# EAGLE design thermal-flashlight-32u4 (EAGLE 6.5.0)
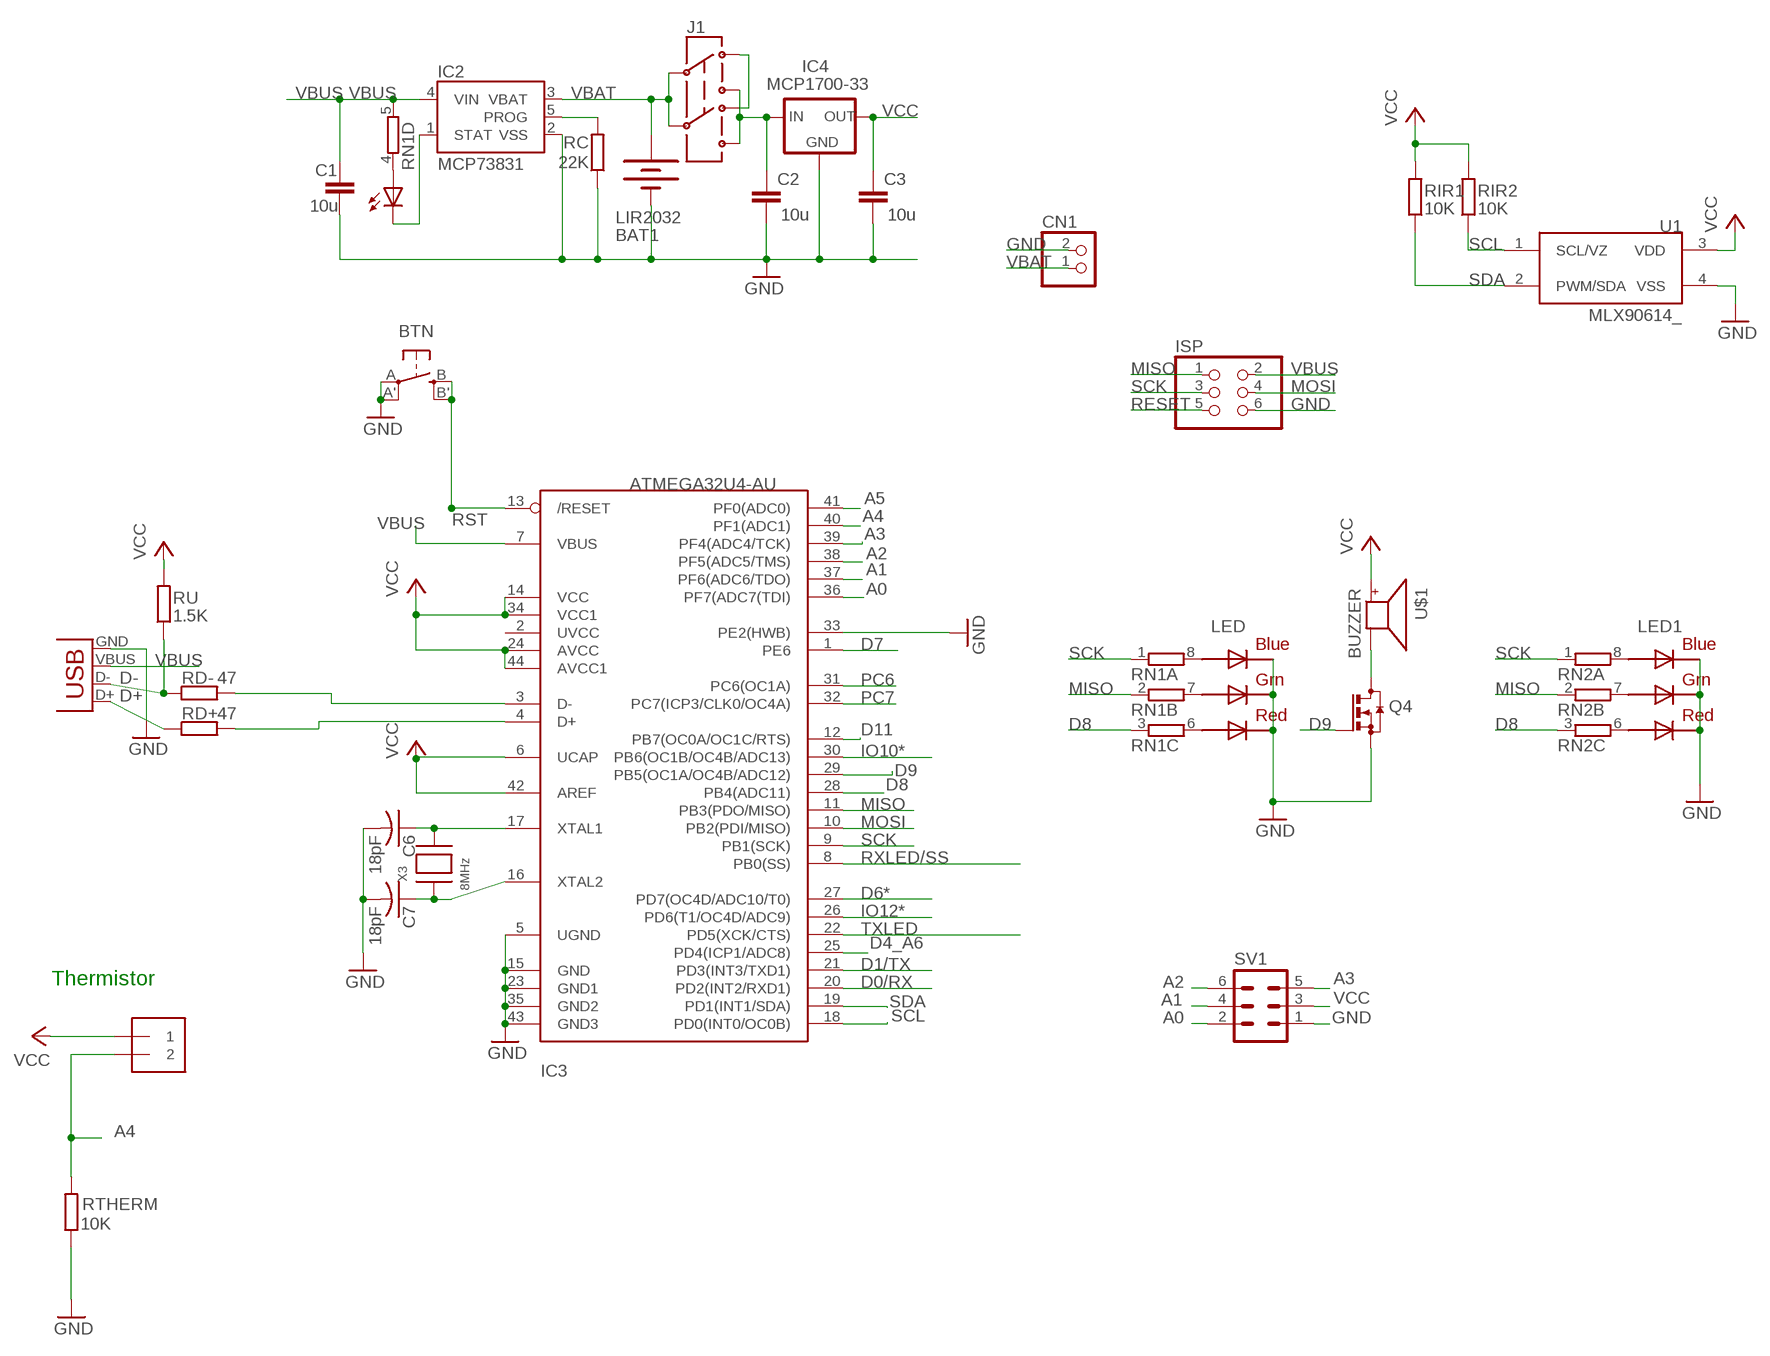
[diagram p0: schematic, sheet 1]

## Parts
BAT1  LIR2032  BATTERYBATTCOM_20MM_PTH_SMT  [BATTCOM_20MM_PTH_SMT]
BTN  EVQQ2  [EVQ-Q2]
C1  10u  C-EUC0805  [C0805]
C2  10u  C-EUC0805  [C0805]
C3  10u  C-EUC0805  [C0805]
C6  18pF  C-USC0805K  [C0805K]
C7  18pF  C-USC0805K  [C0805K]
CHG  0805  LEDCHIPLED_0805  [CHIPLED_0805]
CN1  JST_2PIN-SMT-RA  [JST-PH-2-SMT-RA]
IC2  MCP73831  [SOT23-5]
IC3  ATMEGA32U4-AU  [TQFP44]
IC4  MCP1700-33  MCP1700SOT233  [SOT23]
ISP  PINHD-2X3  [2X03]
J1  AYZ0202  [AYZ0202]
J2  1X2-3.5MM  [1X2-3.5MM]
LED  RGBLED5050  [RGBLED5050]
LED1  RGBLED5050  [RGBLED5050]
Q4  BSS123  [SOT23]
RC  22K  R-EU_R0805  [R0805]
RD+  47  R-EU_R0805  [R0805]
RD-  47  R-EU_R0805  [R0805]
RIR1  10K  R-EU_R0805  [R0805]
RIR2  10K  R-EU_R0805  [R0805]
RN1  4R-NEXB38V  [EXB38V]
RN2  4R-NEXB38V  [EXB38V]
RTHERM  10K  R-EU_R0805  [R0805]
RU  1.5K  R-EU_R0805  [R0805]
SV1  MA03-2  [MA03-2]
U1  MLX90614_  [TO-39]
U$1  BUZZER  [SMT-8585-BUZZER]
X1  USBSMD  [USB-MINIB]
X3  8MHz  XTALNX5032  [NX5032]

## Nets
A0: IC3.36(PF7(ADC7(TDI)) SV1.2
A1: IC3.37(PF6(ADC6/TDO)) SV1.4
A2: IC3.38(PF5(ADC5/TMS)) SV1.6
A3: IC3.39(PF4(ADC4/TCK)) SV1.5
A4: IC3.40(PF1(ADC1)) J2.2 RTHERM.2
A5: IC3.41(PF0(ADC0))
D0/RX: IC3.20(PD2(INT2/RXD1))
D1/TX: IC3.21(PD3(INT3/TXD1))
D4_A6: IC3.25(PD4(ICP1/ADC8))
D6*: IC3.27(PD7(OC4D/ADC10/T0))
D7: IC3.1(PE6)
D8: IC3.28(PB4(ADC11)) RN1.3 RN2.3
D9: IC3.29(PB5(OC1A/OC4B/ADC12)) Q4.1(G)
D11: IC3.12(PB7(OC0A/OC1C/RTS))
D+: RD+.1 X1.D+
D-: RD-.1 RU.1 X1.D-
GND: BAT1.P$1(-) BTN.A'(P1) BTN.A(P) C1.2 C2.2 C3.2 C6.2 C7.2 CN1.2 IC2.2(VSS) IC3.5(UGND) IC3.15(GND) IC3.23(GND1) IC3.33(PE2(HWB)) IC3.35(GND2) IC3.43(GND3) IC4.1(GND) ISP.6 LED1.4(BLUE_C) LED1.5(RED_C) LED1.6(GREEN_C) LED.4(BLUE_C) LED.5(RED_C) LED.6(GREEN_C) Q4.2(S) RC.1 RTHERM.1 SV1.1 U1.4(VSS) X1.GND
IO10*: IC3.30(PB6(OC1B/OC4B/ADC13))
IO12*: IC3.26(PD6(T1/OC4D/ADC9))
MISO: IC3.11(PB3(PDO/MISO)) ISP.1 RN1.2 RN2.2
MOSI: IC3.10(PB2(PDI/MISO)) ISP.4
N$1: J1.3 J1.6
N$2: LED1.3(BLUE_A) RN2.8
N$3: LED1.1(GREEN_A) RN2.7
N$4: LED.3(BLUE_A) RN1.8
N$5: CHG.C IC2.1(STAT)
N$6: IC2.5(PROG) RC.2
N$7: Q4.3(D) U$1.-
N$8: LED.1(GREEN_A) RN1.7
N$9: LED.2(RED_A) RN1.6
N$10: CHG.A RN1.4
N$11: IC3.4(D+) RD+.2
N$12: LED1.2(RED_A) RN2.6
N$15: C7.1 IC3.16(XTAL2) X3.P$1
N$16: C6.1 IC3.17(XTAL1) X3.P$2
N$18: IC3.3(D-) RD-.2
PC6: IC3.31(PC6(OC1A))
PC7: IC3.32(PC7(ICP3/CLK0/OC4A))
RESET: ISP.5
RST: BTN.B'(S1) BTN.B(S) IC3.13(/RESET)
RXLED/SS: IC3.8(PB0(SS))
SCK: IC3.9(PB1(SCK)) ISP.3 RN1.1 RN2.1
SCL: IC3.18(PD0(INT0/OC0B)) RIR2.1 U1.1(SCL/VZ)
SDA: IC3.19(PD1(INT1/SDA)) RIR1.1 U1.2(PWM/SDA)
TXLED: IC3.22(PD5(XCK/CTS))
VBAT: BAT1.P$2(+) CN1.1 IC2.3(VBAT) J1.2 J1.5
VBUS: C1.1 IC2.4(VIN) IC3.7(VBUS) ISP.2 RN1.5 X1.VBUS
VCC: C3.1 IC3.6(UCAP) IC3.14(VCC) IC3.24(AVCC) IC3.34(VCC1) IC3.42(AREF) IC3.44(AVCC1) IC4.2(OUT) J2.1 RIR1.2 RIR2.2 RU.2 SV1.3 U1.3(VDD) U$1.+
VDD: C2.1 IC4.3(IN) J1.1 J1.4
Unconnected: IC3.2(UVCC) RN2.4 RN2.5

## Notes on the sheet
- Thermistor

## Library data of the parts
BAT1 = SparkFunNew:BATTERY: Battery Holders Various common sizes : AA, AAA, 20mm coin cell and 12mm coin cell.
BTN = adafruit:EVQQ2: SMT 6mm switch, EVQQ2 series http://www.ladyada.net/library/eagle
C1-C3 = resistor:C-EU: CAPACITOR, European symbol
C6 C7 = adafruit:C-US: CAPACITOR, American symbol
CHG = led:LED: LED OSRAM: - CHIPLED LG R971, LG N971, LY N971, LG Q971, LY Q971, LO R971, LY R971 LH N974, LH R974 LS Q976, LO Q976, LY Q976 LO Q996 - Hyper CHIPLED LW Q18S LB Q993, LB Q99A, LB R99A - SideLED LS A670, LO A670, LY A670, LG A670, LP A670 LB A673, LV A673, LT A673, LW A673 LH A674 LY A675 LS A676, LA A676, LO A676, LY A676, LW A676 LS A679, LY A679, LG A679 - Hyper Micro SIDELED® LS Y876, LA Y876, LO Y876, LY Y876 LT Y87S - SmartLED LW L88C, LW L88S LB L89C, LB L89S, LG L890 LS L89K, LO L89K, LY L89K LS L896, LA L896, LO L896, LY L896 - TOPLED LS T670, LO T670, LY T670, LG T670, LP T670 LSG T670, LSP T670, LSY T670, LOP T670, LYG T670 LG T671, LOG T671, LSG T671 LB T673, LV T673, LT T673, LW T673 LH T674 LS T676, LA T676, LO T676, LY T676, LB T676, LH T676, LSB T676, LW T676 LB T67C, LV T67C, LT T67C, LS T67K, LO T67K, LY T67K, LW E67C LS E67B, LA E67B, LO E67B, LY E67B, LB E67C, LV E67C, LT E67C LW T67C LS T679, LY T679, LG T679 LS T770, LO T770, LY T770, LG T770, LP T770 LB T773, LV T773, LT T773, LW T773 LH T774 LS E675, LA E675, LY E675, LS T675 LS T776, LA T776, LO T776, LY T776, LB T776 LHGB T686 LT T68C, LB T68C - Hyper Mini TOPLED® LB M676 - Mini TOPLED Santana® LG M470 LS M47K, LO M47K, LY M47K Source: http://www.osram.convergy.de LUXEON: - LUMILED® LXK2-PW12-R00, LXK2-PW12-S00, LXK2-PW14-U00, LXK2-PW14-V00 LXK2-PM12-R00, LXK2-PM12-S00, LXK2-PM14-U00 LXK2-PE12-Q00, LXK2-PE12-R00, LXK2-PE12-S00, LXK2-PE14-T00, LXK2-PE14-U00 LXK2-PB12-K00, LXK2-PB12-L00, LXK2-PB12-M00, LXK2-PB14-N00, LXK2-PB14-P00, LXK2-PB14-Q00 LXK2-PR12-L00, LXK2-PR12-M00, LXK2-PR14-Q00, LXK2-PR14-R00 LXK2-PD12-Q00, LXK2-PD12-R00, LXK2-PD12-S00 LXK2-PH12-R00, LXK2-PH12-S00 LXK2-PL12-P00, LXK2-PL12-Q00, LXK2-PL12-R00 Source: www.luxeon.com KINGBRIGHT: KA-3528ASYC Source: www.kingbright.com
CN1 = adafruit:JST_2PIN: JST 2-Pin Connectors of various flavors SMT-RA (S2B-PH-SM4) 4UConnector #17311 SMT (B2B-PH-SM4) THM-RA (S2B-PH) THM (B2B-PH)
IC2 = SparkFunNew:MCP73831: Microchip's MCP73831 Miniature single cell, fully integrated Li-Ion, Li-polymer charge management controller http://ww1.microchip.com/downloads/en/DeviceDoc/21984a.pdf
IC3 = adaprog:ATMEGA32U4
IC4 = adafruit:MCP1700: VOLTAGE REGULATOR
ISP = pinhead:PINHD-2X3: PIN HEADER
J1 = SparkFunNew:AYZ0202: SPDT Slide Switch Simple SMD single-pull double-throw slide switch. Good for less than 350mA power switch, switching UARTs between devices, etc. Spark Fun Electronics SKU : COM-00597
J2 = adafruit:1X2: 3.5mm Terminal block http://www.ladyada.net/library/pcb/eaglelibrary.html
LED LED1 = adafruit:RGBLED: For 5050 RGB LEDs, the order of the LEDs may vary from one manufacturer to another!
Q4 = transistor-small-signal:BSS123: N-CHANNEL MOS FET
RC RD+ RD- RIR1 RIR2 RTHERM RU = rcl:R-EU_: RESISTOR, European symbol
RN1 RN2 = resistor-dil:4R-N: Array Chip Resistor Source: RS Component / Phycomp; OC_FARNELL: unknown; OC_NEWARK: unknown
SV1 = con-lstb:MA03-2: PIN HEADER; OC_FARNELL: unknown; OC_NEWARK: unknown
U1 = SparkFun:MLX90614: Melexis IR Thermometer
U$1 = adafruit:BUZZER
X1 = SparkFun:USB: USB Connectors USB-B-PTH is fully proven SKU : PRT-00139 USB-miniB is fully proven SKU : PRT-00587 USB-A-PCB is untested. USB-A-H is throughly reviewed, but untested. Spark Fun Electronics SKU : PRT-00437 USB-B-SMT is throughly reviewed, but untested. Needs silkscreen touching up. USB-A-S has not been used/tested USB-MB-H has not been used/tested
X3 = adaprog:XTAL

## Net classes
1 power: width 0.254 mm, clearance 0.203 mm

## Board
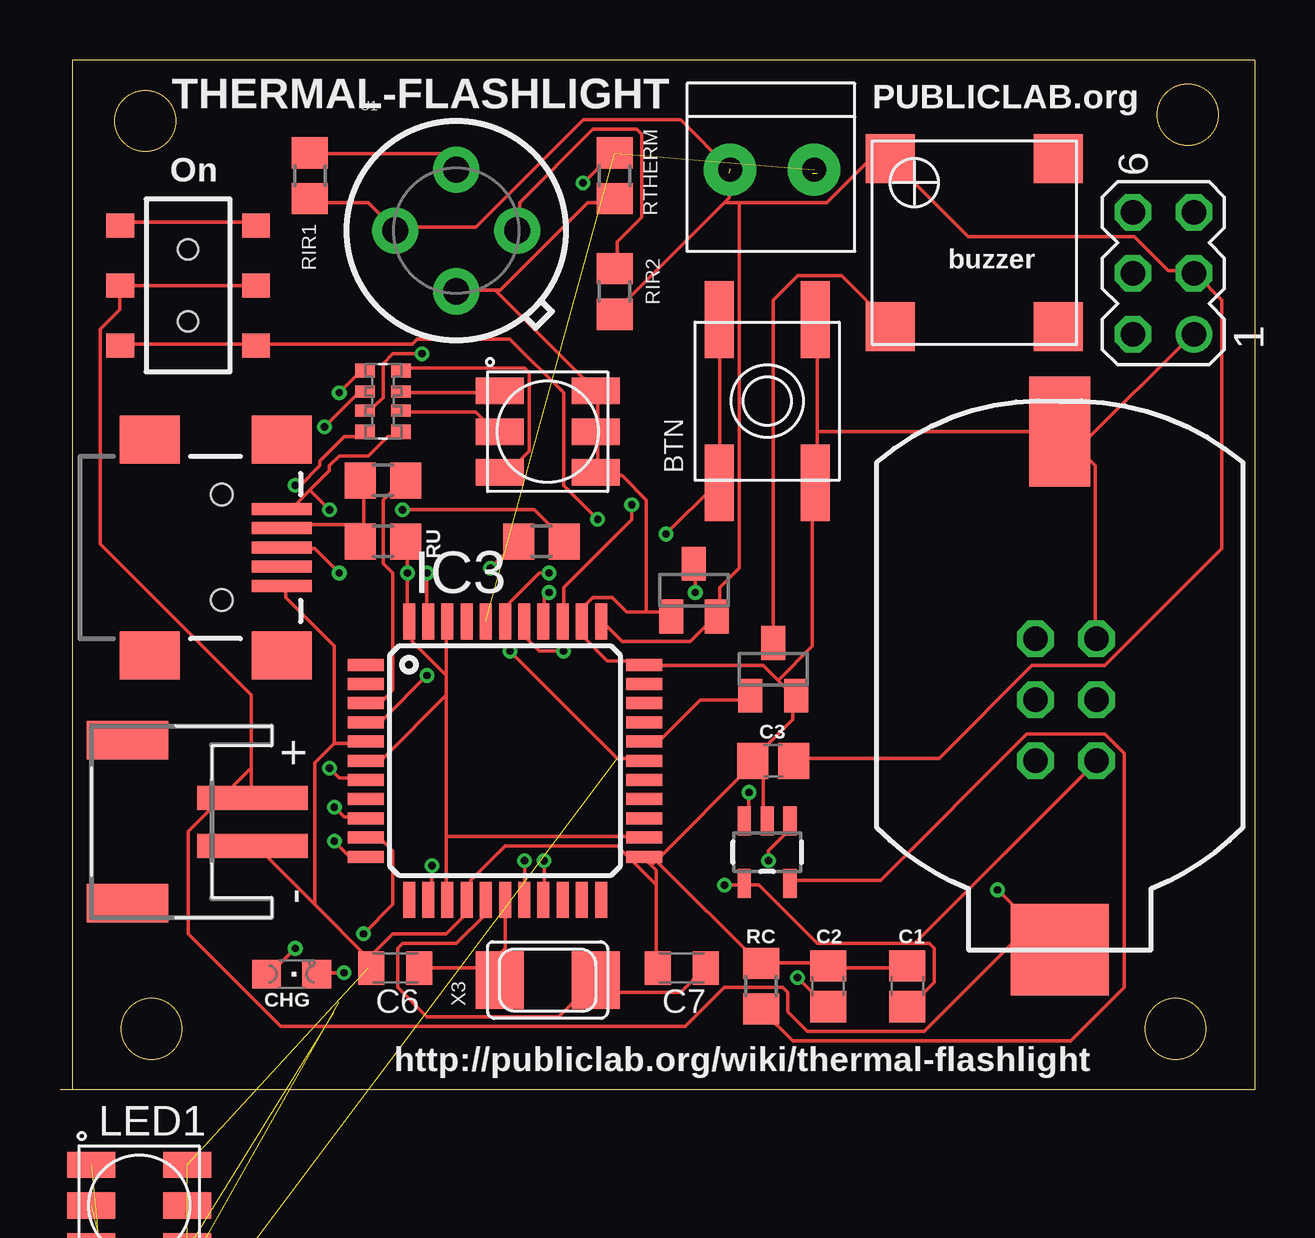
[diagram p1: board, top side]
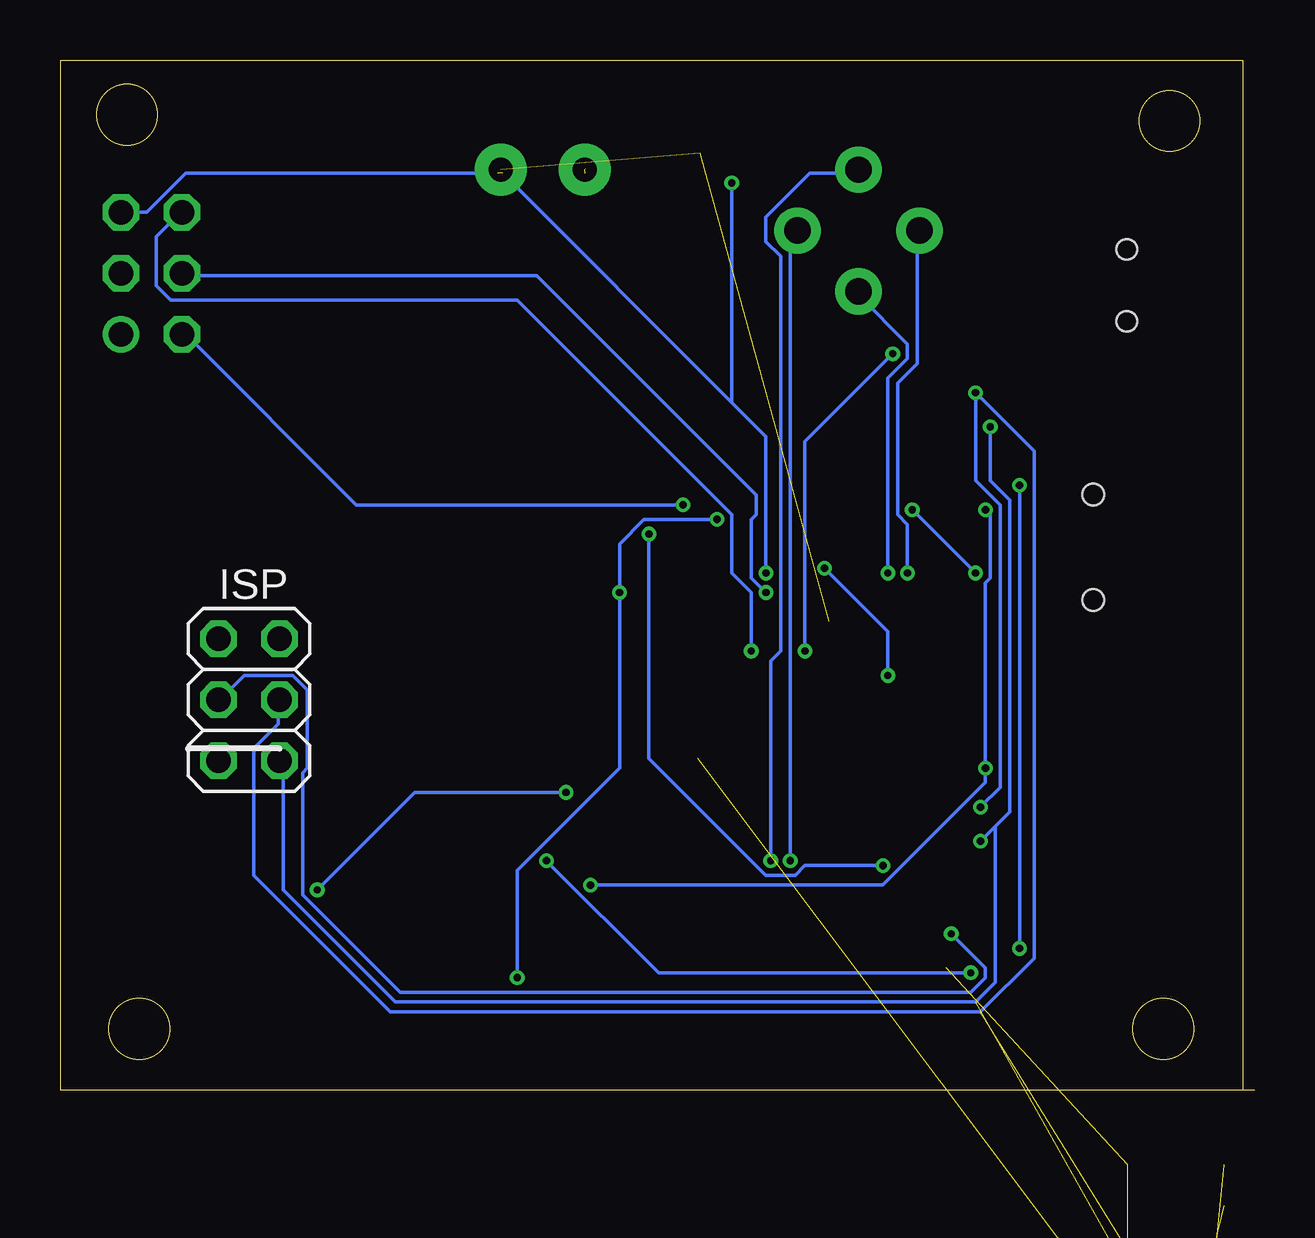
[diagram p2: board, bottom side, seen from below]

Size 49.78 x 42.93 mm. Coordinates in mm from the lower left corner, seen from the top.
Outline: 0.51,0 49.78,0 49.78,42.93 0.51,42.93 0.51,0
Outline: 0.51,0 0,0
Outline: circle at 3.81,2.54 radius 1.27
Outline: circle at 3.56,40.39 radius 1.27
Outline: circle at 46.99,40.64 radius 1.27
Outline: circle at 46.48,2.54 radius 1.27
Copper layers (1*16): Top 0.035mm / dielectric 1.5mm / Bottom 0.035mm
Design rules "Fusion_eagle_rule_v1.1 *": minimum track width 6mil, minimum drill 12mil, track to track 6mil, track to pad 6mil, pad to pad 6mil, via to via 6mil, smd to smd 0mil, copper to edge 10mil, drill to drill 10mil, minimum pad ring 10mil, minimum via ring 6mil, stop-mask expansion 2mil, vias tented up to drill 100mil, thermal gap 25mil
vRestrict: area 8.9,4.3 to 10.4,5.1

### Footprints (pad centres in the part's own frame; a part is rotated, then mirrored left to right if it is on the bottom)
BATTCOM_20MM_PTH_SMT = smd 4.572 x 2.54: P$1 0,0 | smd 3.81 x 4.064: P$2 21.59,0
EVQ-Q2 = smd 3.2 x 1.2: A -3.4,-2; A' 3.4,-2; B -3.4,2; B' 3.4,2
C0805 = smd 1.3 x 1.5: 1 -0.85,0; 2 0.85,0
C0805K = smd 1.1 x 1.4: 1 -1,0; 2 1,0
CHIPLED_0805 = smd 1.2 x 1.2: A 0,-1.05; C 0,1.05
JST-PH-2-SMT-RA = smd 1 x 4.6: 1 1,-3.7; 2 -1,-3.7 | smd 1.6 x 3.4: NC1 -3.4,1.5; NC2 3.4,1.5
SOT23-5 = smd 0.55 x 1.2: 1 -0.95,-1.3; 2 0,-1.3; 3 0.95,-1.3; 4 0.95,1.3; 5 -0.95,1.3
TQFP44 = smd 1.5 x 0.5: 1 -5.8,4; 2 -5.8,3.2; 3 -5.8,2.4; 4 -5.8,1.6; 5 -5.8,0.8; 6 -5.8,0; 7 -5.8,-0.8; 8 -5.8,-1.6; 9 -5.8,-2.4; 10 -5.8,-3.2; 11 -5.8,-4; 23 5.8,-4; 24 5.8,-3.2; 25 5.8,-2.4; 26 5.8,-1.6; 27 5.8,-0.8; 28 5.8,0; 29 5.8,0.8; 30 5.8,1.6; 31 5.8,2.4; 32 5.8,3.2; 33 5.8,4 | smd 0.5 x 1.5: 12 -4,-5.8; 13 -3.2,-5.8; 14 -2.4,-5.8; 15 -1.6,-5.8; 16 -0.8,-5.8; 17 0,-5.8; 18 0.8,-5.8; 19 1.6,-5.8; 20 2.4,-5.8; 21 3.2,-5.8; 22 4,-5.8; 34 4,5.8; 35 3.2,5.8; 36 2.4,5.8; 37 1.6,5.8; 38 0.8,5.8; 39 0,5.8; 40 -0.8,5.8; 41 -1.6,5.8; 42 -2.4,5.8; 43 -3.2,5.8; 44 -4,5.8
SOT23 = smd 1 x 1.4: 1 -0.95,-1.1; 2 0.95,-1.1; 3 0,1.1
2X03 = drill 1.016 octagon: 1 -2.54,-1.27; 2 -2.54,1.27; 3 0,-1.27; 4 0,1.27; 5 2.54,-1.27; 6 2.54,1.27
AYZ0202 = smd 1 x 1.15: 1 -2.5,2.825; 2 0,2.825; 3 2.5,2.825; 4 -2.5,-2.825; 5 0,-2.825; 6 2.5,-2.825 | hole 0.85: 1.5,0; -1.5,0
1X2-3.5MM = drill 1 pad 2.184: 1 1.8,0; 2 -1.7,0
RGBLED5050 = smd 2 x 1.1: 1 -2,1.7; 2 -2,0; 3 -2,-1.7; 4 2,-1.7; 5 2,0; 6 2,1.7
R0805 = smd 1.3 x 1.5: 1 -0.95,0; 2 0.95,0
EXB38V = smd 0.6 x 0.8: 1 -1.275,-0.75; 4 1.275,-0.75; 5 1.275,0.75; 8 -1.275,0.75 | smd 0.5 x 0.8: 2 -0.4,-0.75; 3 0.4,-0.75; 6 0.4,0.75; 7 -0.4,0.75
MA03-2 = drill 1.016: 1 -2.54,-1.27 | drill 1.016 octagon: 2 -2.54,1.27; 3 0,-1.27; 4 0,1.27; 5 2.54,-1.27; 6 2.54,1.27
TO-39 = drill 1.1 pad 1.93: 1 2.54,0; 2 0,2.54; 3 -2.54,0; 4 0,-2.54
SMT-8585-BUZZER = smd 2.05 x 2.05: + -3.5,-3.5; - 3.5,-3.5; NC1 -3.5,3.5; NC2 3.5,3.5
USB-MINIB = smd 2.5 x 0.5: D+ 2.5,0; D- 2.5,0.8; GND 2.5,-1.6; ID 2.5,-0.8; VBUS 2.5,1.6 | smd 2.5 x 2: GND@1 -3,-4.5; GND@2 -3,4.5; GND@3 2.5,4.5; GND@4 2.5,-4.5 | hole 0.9: 0,2.2; 0,-2.2
NX5032 = smd 2 x 2.4: P$1 2,0; P$2 -2,0

### Placement (x,y rotation side)
BAT1  41.66,27.43 270 top
BTN  29.46,28.7 90 top
C1  35.31,4.32 90 top
C2  32,4.32 90 top
C3  29.72,13.72 180 top
C6  13.97,5.08 180 top
C7  25.91,5.08 180 top
CHG  9.65,4.83 270 top
CN1  4.32,11.18 90 top
IC2  29.46,9.91 180 top
IC3  18.54,13.72 0 top
IC4  26.42,20.83 0 top
ISP  41.91,16.26 90 bottom
J1  5.33,33.53 90 top
J2  29.72,38.35 180 top
LED  20.32,27.43 0 top
LED1  3.3,-4.83 0 top  (outside the outline)
Q4  29.72,17.53 0 top
RC  29.21,4.32 270 top
RD+  20.07,22.86 180 top
RD-  13.46,25.4 0 top
RIR1  10.41,38.1 270 top
RIR2  23.11,33.27 270 top
RN1  13.46,28.7 270 top
RN2  2.54,-12.45 0 top  (outside the outline)
RTHERM  23.11,38.1 90 top
RU  13.46,22.86 0 top
SV1  45.97,34.04 90 top
U1  16.51,35.81 0 top
U$1  38.1,35.31 270 top
X1  6.73,22.61 0 top
X3  20.32,4.57 0 top

### Tracks (layer width: path | path; a pad name or v marks a point on that pad's centre or on a via)
A0  (via drill 0.3)
  Top 0.152: v23.83,24.38 23.83,23.77 20.98,20.93 20.98,19.71 IC3.36
  Bottom 0.152: v23.83,24.38 37.44,24.38 44.55,31.5 SV1.2
A1  (via drill 0.3)
  Top 0.152: v20.37,20.73 20.17,20.52 20.17,19.71 IC3.37
  Bottom 0.152: v20.37,20.73 20.98,21.34 20.98,23.77 20.78,23.98 20.78,24.79 29.92,33.93 44.55,33.93 SV1.4
A2  (via drill 0.3)
  Top 0.152: v20.98,18.29 19.96,18.29 19.36,18.9 19.36,19.51 IC3.38
  Bottom 0.152: v20.98,18.29 20.98,20.73 21.79,21.54 21.79,23.98 30.73,32.92 45.16,32.92 45.77,33.53 45.77,35.56 44.75,36.58 SV1.6
A3  (via drill 0.3)  (1 unrouted)
  Top 0.152: IC3.39 18.54,20.12 19.96,21.54 v20.37,21.54 | v21.79,37.8 23.01,39.01
  Bottom 0.152: v20.37,21.54 20.37,27.23 21.79,28.65 | 31.34,38.2 21.79,28.65 | 21.79,28.65 v21.79,37.8 | SV1.5 46.18,36.58 44.55,38.2 31.55,38.2
A4  (2 unrouted)
D8  (via drill 0.3)  (1 unrouted)
  Top 0.152: v15.09,30.68 13.87,30.68 13.46,30.28 13.46,28.85 13.06,28.45 12.85,28.45 RN1.3 | v18.75,18.29 23.22,13.82 24.23,13.82 IC3.28
  Bottom 0.152: v15.09,30.68 18.75,27.03 v18.75,18.29
D9
  Top 0.152: Q4.1 28.7,16.26 26.67,16.26 25.04,14.63 24.44,14.63 IC3.29
D+  (via drill 0.3)
  Top 0.152: v14.28,24.18 19.76,24.18 20.98,22.96 RD+.1 | v11.63,21.54 10.62,22.55 9.4,22.55 X1.D+
  Bottom 0.152: v11.63,21.54 v14.28,24.18
D-
  Top 0.152: 12.65,23.57 12.65,25.4 RD-.1 | 12.65,23.57 12.65,22.96 RU.1 12.65,23.57 | 12.65,23.57 9.4,23.57 X1.D-
GND  (via drill 0.3)  (3 unrouted)
  Top 0.152: 31.55,27.43 31.55,31.9 BTN.A' | 31.55,27.43 31.55,25.4 BTN.A 31.34,25.2 31.34,18.49 29.92,17.07 | 42.32,26.82 41.71,27.43 BAT1.P$1 | 42.32,26.82 43.13,26.01 43.13,18.9 ISP.6 | 42.32,26.82 42.52,26.82 47.19,31.5 SV1.1 | 42.32,26.82 BAT1.P$1 | BAT1.P$1 31.55,27.43 | 12.85,5.49 12.85,5.08 C6.2 12.85,5.49 | 10.62,7.72 8.18,10.16 CN1.2 | 10.62,7.72 12.85,5.49 | 12.85,5.49 13.87,6.5 16.1,6.5 16.92,7.32 16.92,7.72 IC3.15 17.12,7.92 17.12,8.74 18.54,10.16 23.22,10.16 24.84,8.53 | 11.43,14.43 12.65,14.43 IC3.5 | 11.43,14.43 10.62,13.61 10.62,7.72 | 11.43,14.43 11.43,18.49 9.4,20.52 9.4,20.93 X1.GND | 22.4,27.43 22.4,25.81 LED.4 22.4,25.6 23.42,25.6 24.44,24.59 24.44,19.91 | 22.4,27.43 22.4,29.06 LED.6 22.2,29.26 18.14,33.33 | 22.4,27.43 LED.5 | v15.29,21.54 15.29,19.71 IC3.43 | 18.14,33.33 16.51,33.33 U1.4 | 18.14,33.33 18.34,33.33 22,36.98 23.01,36.98 RTHERM.1 | C1.2 35.2,5.08 32.16,5.08 C2.2 31.95,5.28 29.31,5.28 RC.1 29.11,5.28 24.84,9.55 | 24.44,19.91 23.62,19.91 23.01,20.52 22.2,20.52 21.79,20.12 21.79,19.71 IC3.35 21.79,19.51 21.79,18.9 22.81,17.88 24.23,17.88 IC3.33 24.44,17.68 29.31,17.68 29.92,17.07 | 24.44,19.91 25.45,19.91 IC4.1 | 24.84,8.53 24.84,9.14 24.64,9.35 | 24.84,8.53 24.84,5.08 C7.2 | 24.64,9.35 24.44,9.55 IC3.23 24.84,9.55 | 28.91,13.61 29.31,13.21 29.31,11.38 IC2.2 | 28.91,13.61 24.84,9.55 | 24.84,9.55 24.64,9.35 | 28.91,13.61 C3.2 28.91,13.82 30.53,15.44 30.53,16.26 Q4.2 30.53,16.46 29.92,17.07
  Bottom 0.152: v15.29,21.54 15.29,29.67 14.48,30.48 14.48,31.09 16.51,33.12 U1.4
MISO  (via drill 0.3)  (1 unrouted)
  Top 0.152: v11.02,27.64 12.45,29.06 12.65,29.06 RN1.2 | v11.43,10.36 12.04,9.75 12.65,9.75 IC3.11
  Bottom 0.152: v11.02,27.64 11.02,25.4 10.21,24.59 10.21,11.58 10.82,10.97 | v11.43,10.36 10.82,10.97 | 10.82,10.97 10.82,4.47 11.63,3.66 35.81,3.66 40.49,8.33 40.49,13.61 ISP.1
MOSI  (via drill 0.3)
  Top 0.152: v12.65,6.5 13.87,7.72 13.87,9.96 13.46,10.36 12.85,10.36 IC3.10
  Bottom 0.152: v12.65,6.5 11.23,5.08 11.23,4.67 11.84,4.06 35.61,4.06 39.67,8.13 39.67,13.21 39.47,13.41 39.47,16.66 40.08,17.27 42.11,17.27 43.13,16.26 ISP.4
N$1
  Top 0.152: J1.3 2.69,36.17 7.98,36.17 J1.6
N$2  (1 unrouted)
N$3  (1 unrouted)
N$4
  Top 0.152: RN1.8 14.28,30.07 19.36,30.07 19.56,29.87 19.56,26.62 18.75,25.81 18.34,25.81 LED.3
N$5  (via drill 0.3)
  Top 0.152: v11.84,4.88 10.82,4.88 CHG.C | v29.52,9.55 29.52,9.96 30.33,10.77 30.33,11.18 IC2.1
  Bottom 0.152: v11.84,4.88 24.84,4.88 v29.52,9.55
N$6
  Top 0.152: IC2.5 30.53,8.74 34.19,8.74 40.28,14.83 43.54,14.83 44.35,14.02 44.35,4.27 42.11,2.03 30.53,2.03 29.31,3.25 RC.2
N$7
  Top 0.152: Q4.3 29.72,32.92 30.73,33.93 32.56,33.93 34.59,31.9 U$1.-
N$8
  Top 0.152: RN1.7 14.28,29.06 18.14,29.06 LED.1
N$9
  Top 0.152: RN1.6 14.28,28.25 17.32,28.25 18.14,27.43 LED.2
N$10  (via drill 0.3)
  Top 0.152: v9.8,25.2 10.01,25.2 10.82,26.01 10.82,26.21 11.84,27.23 12.65,27.23 RN1.4 | v9.8,5.89 8.79,4.88 CHG.A
  Bottom 0.152: v9.8,5.89 v9.8,25.2
N$11  (via drill 0.3)
  Top 0.152: v15.29,17.27 13.46,15.44 12.85,15.44 IC3.4 | v17.93,21.74 18.95,22.76 RD+.2
  Bottom 0.152: v15.29,17.27 15.29,19.1 v17.93,21.74
N$12  (1 unrouted)
N$15
  Top 0.152: C7.1 26.87,5.08 25.86,4.06 22.81,4.06 22.4,4.47 X3.P$1 22.2,4.47 20.78,3.05 15.29,3.05 14.07,4.27 14.07,5.89 14.28,6.1 16.51,6.1 17.73,7.32 17.73,7.72 IC3.16
N$16
  Top 0.152: 17.73,5.08 C6.1 | 17.73,5.08 18.14,4.67 X3.P$2 17.73,5.08 | IC3.17 18.54,5.89 17.73,5.08
N$18
  Top 0.152: IC3.3 12.85,16.26 13.46,16.26 13.87,16.66 13.87,21.54 13.46,21.95 13.46,24.59 14.28,25.4 RD-.2
RST  (via drill 0.3)
  Top 0.152: v15.49,9.35 15.49,7.92 IC3.13 | v25.25,23.16 27.28,25.2 BTN.B 27.48,25.4 27.48,31.9 BTN.B'
  Bottom 0.152: v15.49,9.35 18.75,9.35 19.15,8.94 20.37,8.94 25.25,13.82 v25.25,23.16
SCK  (via drill 0.3)  (1 unrouted)
  Top 0.152: v11.63,29.06 12.45,29.87 12.65,29.87 RN1.1 | v11.43,11.79 11.84,11.38 12.65,11.38 IC3.9
  Bottom 0.152: v11.43,11.79 10.62,12.6 10.62,24.38 11.63,25.4 v11.63,29.06 9.2,26.62 9.2,5.49 11.43,3.25 36.02,3.25 41.71,8.94 41.71,14.22 40.69,15.24 40.69,16.26 ISP.3
SCL  (via drill 0.3)
  Top 0.152: v19.36,9.55 IC3.18 | RIR2.1 23.22,34.34 23.22,35.36 24.23,36.37 24.23,39.83 24.03,40.03 22.2,40.03 19.15,36.98 19.15,35.97 U1.1
  Bottom 0.152: v19.36,9.55 19.36,35.56 19.15,35.76 U1.1
SDA  (via drill 0.3)
  Top 0.152: v20.17,9.55 20.17,7.92 IC3.19 | RIR1.1 10.41,39.01 15.9,39.01 16.51,38.41 U1.2
  Bottom 0.152: v20.17,9.55 20.17,17.88 19.76,18.29 19.76,34.75 20.37,35.36 20.37,36.37 18.54,38.2 16.51,38.2 U1.2
VBAT  (via drill 0.3)
  Top 0.152: v28.7,12.39 28.7,11.38 IC2.3 | 40.49,6.91 41.5,5.89 BAT1.P$2 40.49,6.91 | 40.49,6.91 v39.06,8.33 | J1.5 J1.2 2.49,33.53 2.49,32.51 1.68,31.7 1.68,22.76 7.98,16.46 7.98,13.41 | 7.98,13.41 7.98,12.19 CN1.1 | 40.49,6.91 36.02,2.44 31.14,2.44 30.33,3.25 30.33,4.06 30.12,4.27 27.69,4.27 26.06,2.64 9.2,2.64 5.33,6.5 5.33,10.77 7.98,13.41
  Bottom 0.152: v28.7,12.39 35,12.39 v39.06,8.33
VBUS  (via drill 0.3)
  Top 0.152: 10.41,24.99 9.8,24.38 9.4,24.38 X1.VBUS | 10.41,24.99 11.23,25.81 11.23,26.01 11.63,26.42 12.85,26.42 13.66,27.23 14.07,27.23 RN1.5 | v11.23,13.41 11.63,13.01 12.65,13.01 IC3.7 | 10.41,24.99 v11.23,24.18 | 35.61,6.1 36.22,6.1 36.42,5.89 36.42,4.47 35.41,3.45 C1.1 | 35.61,6.1 31.55,6.1 29.11,8.53 28.7,8.53 IC2.4 28.5,8.53 v27.69,8.53 | 35.61,6.1 43.13,13.61 ISP.2
  Bottom 0.152: v11.23,24.18 11.02,23.98 11.02,21.34 11.23,21.13 v11.23,13.41 11.23,12.8 15.49,8.53 v27.69,8.53
VCC  (via drill 0.3)  (2 unrouted)
  Top 0.152: C3.1 30.73,13.82 36.63,13.82 40.49,17.68 43.54,17.68 48.41,22.55 48.41,32.92 47.4,33.93 SV1.3 47.19,34.14 46.18,34.14 44.75,35.56 37.85,35.56 U$1.+ 34.59,38.61 33.58,38.61 31.95,36.98 28.3,36.98 | RU.2 14.48,22.76 v14.48,21.54 14.48,19.71 IC3.44 14.68,19.51 14.68,18.69 16.1,17.27 | 16.1,16.46 13.46,13.82 12.85,13.82 IC3.6 | 16.1,17.27 16.1,19.51 IC3.42 | 16.1,17.27 16.1,16.46 | 16.1,16.46 16.1,10.57 | 16.1,10.57 16.1,7.92 IC3.14 | 16.1,10.57 24.23,10.57 IC3.24 | RIR1.2 10.41,36.98 12.85,36.98 13.87,35.97 U1.3 14.07,35.97 17.32,35.97 21.79,40.44 25.86,40.44 27.89,38.41 | IC3.34 22.61,19.51 23.42,18.69 26.26,18.69 27.28,19.71 IC4.2 27.48,19.91 27.48,20.93 28.3,21.74 28.3,36.98 | 27.69,36.98 27.89,37.19 27.89,38.2 | 27.69,36.98 23.22,32.51 RIR2.2 | 27.69,36.98 28.3,36.98
  Bottom 0.152: v14.48,21.54 14.48,23.57 14.88,23.98 14.88,29.46 14.07,30.28 14.07,35.76 U1.3
VDD  (via drill 0.3)
  Top 0.152: J1.1 2.69,31.09 7.98,31.09 J1.4 8.18,31.09 14.68,31.09 14.88,31.29 18.75,31.29 20.98,29.06 20.98,25.2 v22.4,23.77 | v26.47,20.73 26.47,21.74 IC4.3 | v30.73,4.67 31.95,3.45 C2.1
  Bottom 0.152: v30.73,4.67 30.73,9.14 26.47,13.41 v26.47,20.73 26.47,22.76 25.45,23.77 v22.4,23.77

### Text on the board
tNames: THERMAL-FLASHLIGHT | PUBLICLAB.org | On | buzzer | http://publiclab.org/wiki/thermal-flashlight